# EAGLE design Groovegrid_ctrl (EAGLE 9.6.1)
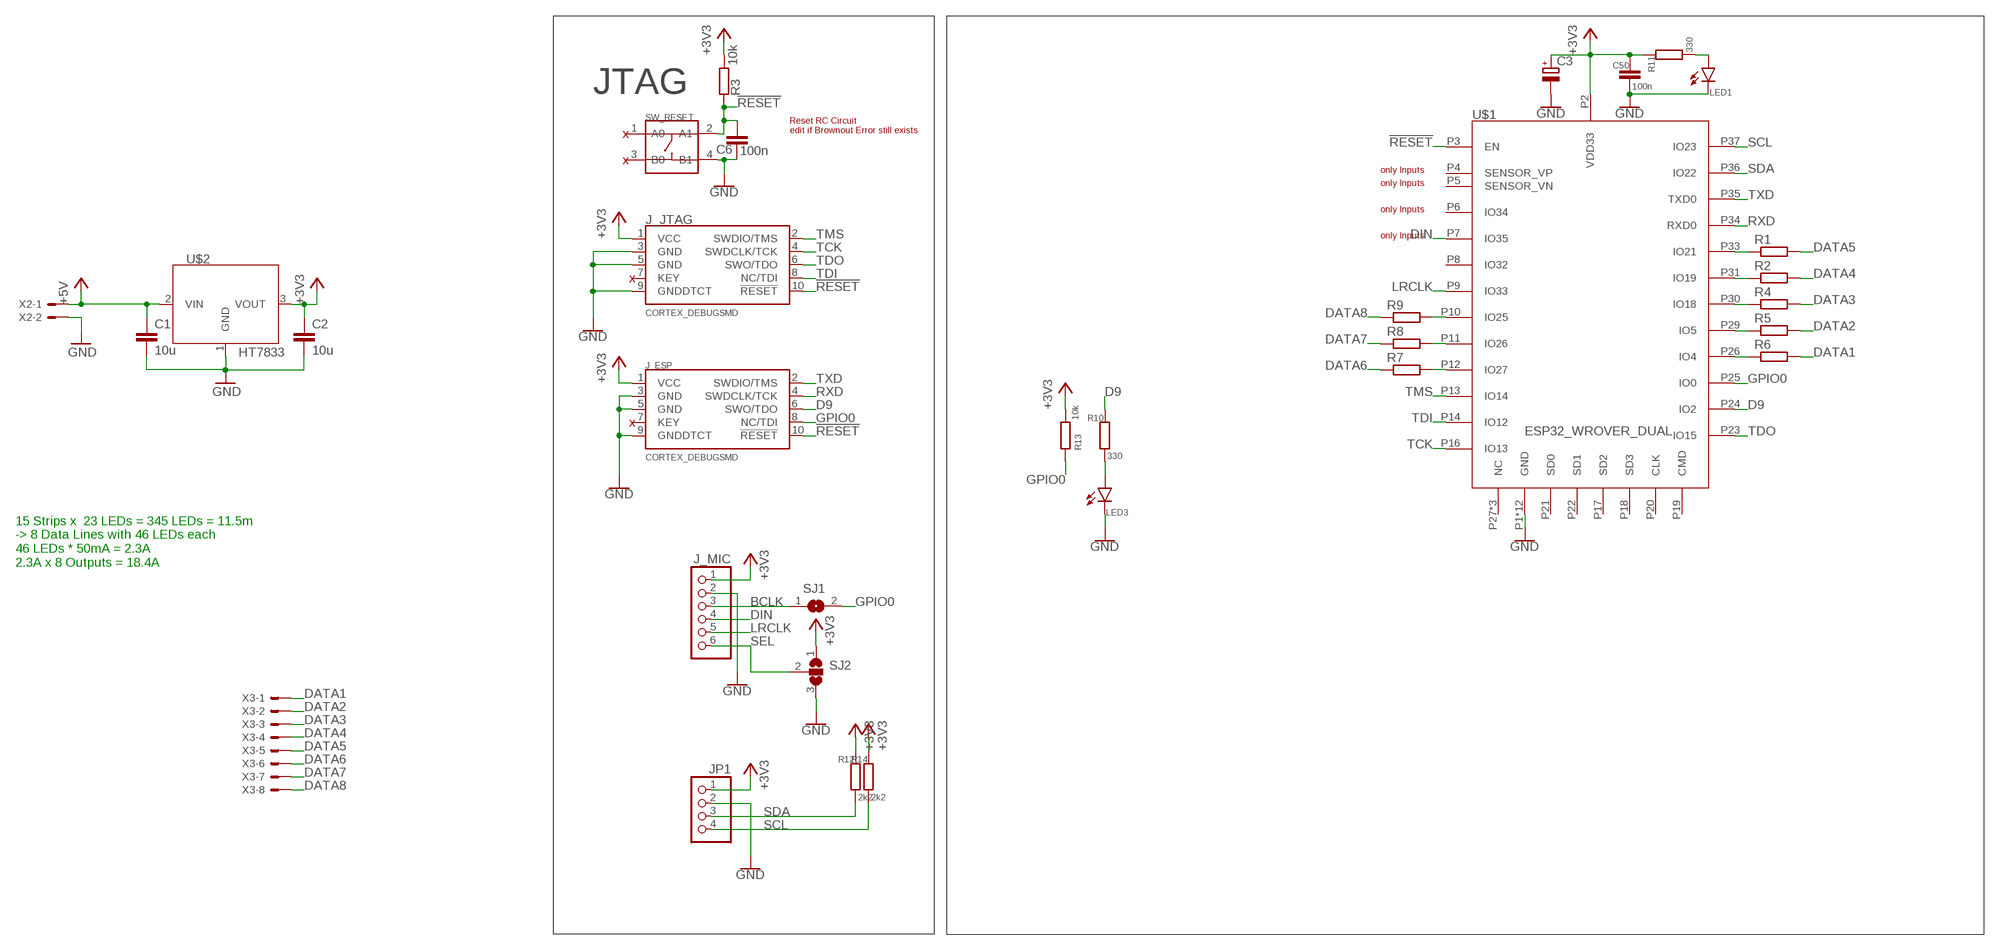
[diagram p0: schematic, sheet 1]

## Parts
C1  10u  C-EUC0805  [C0805]
C2  10u  C-EUC0805  [C0805]
C3  CPOL-EUD  [PANASONIC_D]
C6  100n  C-EUC0805K  [C0805K]
C50  100n  C-EUC0805K  [C0805K]
J_ESP  CORTEX_DEBUGSMD  [2X5_FTSH-105]
J_JTAG  CORTEX_DEBUGSMD  [2X5_FTSH-105]
J_MIC  PINHD-1X6  [1X06]
JP1  PINHD-1X4  [1X04]
LED1  LEDCHIPLED_0805  [CHIPLED_0805]
LED3  LEDCHIPLED_0805  [CHIPLED_0805]
R1  R-EU_R0805  [R0805]
R2  R-EU_R0805  [R0805]
R3  10k  R-EU_R0805  [R0805]
R4  R-EU_R0805  [R0805]
R5  R-EU_R0805  [R0805]
R6  R-EU_R0805  [R0805]
R7  R-EU_R0805  [R0805]
R8  R-EU_R0805  [R0805]
R9  R-EU_R0805  [R0805]
R10  330  R-EU_R0805  [R0805]
R11  330  R-EU_R0805  [R0805]
R12  2k2  R-EU_R0805  [R0805]
R13  10k  R-EU_R0805  [R0805]
R14  2k2  R-EU_R0805  [R0805]
SJ1  SJ  [SJ]
SJ2  SJ2W  [SJ_2]
SW_RESET  SKQGADE010  SMD-BUTTON(4P-5.2X5.2X1.5MM-SKQGADE010)  [SW_4P-5.2X5.2X1.5MM]
U$1  ESP32_WROVER_DUAL  [ESP32_WROVER]
U$2  HT7833  [SOT150P417X160-4N]
X2  JST-XH-02-PIN-ROUND-PAD  [JST-XH-02-PACKAGE-ROUND-PAD]
X3  JST-XH-08-PIN-ROUND-PAD  [JST-XH-08-PACKAGE-ROUND-PAD]

## Nets
!RESET: C6.1 J_ESP.10(!RESET) J_JTAG.10(!RESET) R3.1 SW_RESET.2(A1) U$1.P3(EN)
+3V3: C2.1 C3.+ C50.1 J_ESP.1(VCC) J_JTAG.1(VCC) J_MIC.1 JP1.1 R3.2 R11.1 R12.1 R13.2 R14.1 SJ2.1 U$1.P2(VDD33) U$2.3(VOUT)
+5V: C1.1 U$2.2(VIN) X2.1
BCLK: J_MIC.3 SJ1.1
D9: J_ESP.6(SWO/TDO) R10.1 U$1.P24(IO2)
DATA1: R6.2 X3.1
DATA2: R5.2 X3.2
DATA3: R4.2 X3.3
DATA4: R2.2 X3.4
DATA5: R1.2 X3.5
DATA6: R7.1 X3.6
DATA7: R8.1 X3.7
DATA8: R9.1 X3.8
DIN: J_MIC.4 U$1.P7(IO35)
GND: C1.2 C2.2 C3.- C6.2 C50.2 J_ESP.3(GND) J_ESP.5(GND) J_ESP.9(GNDDTCT) J_JTAG.3(GND) J_JTAG.5(GND) J_JTAG.9(GNDDTCT) J_MIC.2 JP1.2 LED1.C LED3.C SJ2.3 SW_RESET.4(B1) U$1.P1(GND) U$1.P15(GND) U$1.P38(GND) U$1.TH1(GND) U$1.TH2(GND) U$1.TH3(GND) U$1.TH4(GND) U$1.TH5(GND) U$1.TH6(GND) U$1.TH7(GND) U$1.TH8(GND) U$1.TH9(GND) U$2.1(GND) X2.2
GPIO0: J_ESP.8(NC/TDI) R13.1 SJ1.2 U$1.P25(IO0)
LRCLK: J_MIC.5 U$1.P9(IO33)
N$1: R1.1 U$1.P33(IO21)
N$2: R2.1 U$1.P31(IO19)
N$3: R4.1 U$1.P30(IO18)
N$4: R5.1 U$1.P29(IO5)
N$5: LED3.A R10.2
N$6: R6.1 U$1.P26(IO4)
N$7: R7.2 U$1.P12(IO27)
N$8: R8.2 U$1.P11(IO26)
N$9: R9.2 U$1.P10(IO25)
N$10: LED1.A R11.2
RXD: J_ESP.4(SWDCLK/TCK) U$1.P34(RXD0)
SCL: JP1.4 R14.2 U$1.P37(IO23)
SDA: JP1.3 R12.2 U$1.P36(IO22)
SEL: J_MIC.6 SJ2.2
TCK: J_JTAG.4(SWDCLK/TCK) U$1.P16(IO13)
TDI: J_JTAG.8(NC/TDI) U$1.P14(IO12)
TDO: J_JTAG.6(SWO/TDO) U$1.P23(IO15)
TMS: J_JTAG.2(SWDIO/TMS) U$1.P13(IO14)
TXD: J_ESP.2(SWDIO/TMS) U$1.P35(TXD0)
Unconnected: J_ESP.7(KEY) J_JTAG.7(KEY) SW_RESET.1(A0) SW_RESET.3(B0) U$1.P4(SENSOR_VP) U$1.P5(SENSOR_VN) U$1.P6(IO34) U$1.P8(IO32) U$1.P17(SD2) U$1.P18(SD3) U$1.P19(CMD) U$1.P20(CLK) U$1.P21(SD0) U$1.P22(SD1) U$1.P27(NC) U$1.P28(NC) U$1.P32(NC)

## Notes on the sheet
- JTAG
- x
- Reset RC Circuit
  edit if Brownout Error still exists
- x
- only Inputs
- only Inputs
- only Inputs
- only Inputs
- x
- x
- 15 Strips x  23 LEDs = 345 LEDs = 11.5m
  -> 8 Data Lines with 46 LEDs each
  46 LEDs * 50mA = 2.3A
  2.3A x 8 Outputs = 18.4A

## Library data of the parts
C1 C2 C6 C50 = resistor:C-EU: CAPACITOR, European symbol
C3 = resistor:CPOL-EU: POLARIZED CAPACITOR, European symbol
J_ESP J_JTAG = philmalessa:CORTEX_DEBUG: Cortex Debug Connector - 10 pin Supports JTAG debug, Serial Wire debug, and Serial Wire Viewer. PTH and SMD connector options available. General Connector Information <http://infocenter.arm.com/help/topic/com.arm.doc.faqs/attached/13634/cortex_debug_connectors.pdf> Products: PTH Connector <http://www.digikey.com/product-detail/en/cnc-tech/3220-10-0100-00/1175-1627-ND/3883661> -via Digi-Key SparkFun PSoc <https://www.sparkfun.com/products/13229> SparkFun T <https://www.sparkfun.com/products/13810>
J_MIC = pinhead:PINHD-1X6: PIN HEADER
JP1 = pinhead:PINHD-1X4: PIN HEADER
LED1 LED3 = led:LED: LED OSRAM: - CHIPLED LG R971, LG N971, LY N971, LG Q971, LY Q971, LO R971, LY R971 LH N974, LH R974 LS Q976, LO Q976, LY Q976 LO Q996 - Hyper CHIPLED LW Q18S LB Q993, LB Q99A, LB R99A - SideLED LS A670, LO A670, LY A670, LG A670, LP A670 LB A673, LV A673, LT A673, LW A673 LH A674 LY A675 LS A676, LA A676, LO A676, LY A676, LW A676 LS A679, LY A679, LG A679 - Hyper Micro SIDELED® LS Y876, LA Y876, LO Y876, LY Y876 LT Y87S - SmartLED LW L88C, LW L88S LB L89C, LB L89S, LG L890 LS L89K, LO L89K, LY L89K LS L896, LA L896, LO L896, LY L896 - TOPLED LS T670, LO T670, LY T670, LG T670, LP T670 LSG T670, LSP T670, LSY T670, LOP T670, LYG T670 LG T671, LOG T671, LSG T671 LB T673, LV T673, LT T673, LW T673 LH T674 LS T676, LA T676, LO T676, LY T676, LB T676, LH T676, LSB T676, LW T676 LB T67C, LV T67C, LT T67C, LS T67K, LO T67K, LY T67K, LW E67C LS E67B, LA E67B, LO E67B, LY E67B, LB E67C, LV E67C, LT E67C LW T67C LS T679, LY T679, LG T679 LS T770, LO T770, LY T770, LG T770, LP T770 LB T773, LV T773, LT T773, LW T773 LH T774 LS E675, LA E675, LY E675, LS T675 LS T776, LA T776, LO T776, LY T776, LB T776 LHGB T686 LT T68C, LB T68C - Hyper Mini TOPLED® LB M676 - Mini TOPLED Santana® LG M470 LS M47K, LO M47K, LY M47K Source: http://www.osram.convergy.de LUXEON: - LUMILED® LXK2-PW12-R00, LXK2-PW12-S00, LXK2-PW14-U00, LXK2-PW14-V00 LXK2-PM12-R00, LXK2-PM12-S00, LXK2-PM14-U00 LXK2-PE12-Q00, LXK2-PE12-R00, LXK2-PE12-S00, LXK2-PE14-T00, LXK2-PE14-U00 LXK2-PB12-K00, LXK2-PB12-L00, LXK2-PB12-M00, LXK2-PB14-N00, LXK2-PB14-P00, LXK2-PB14-Q00 LXK2-PR12-L00, LXK2-PR12-M00, LXK2-PR14-Q00, LXK2-PR14-R00 LXK2-PD12-Q00, LXK2-PD12-R00, LXK2-PD12-S00 LXK2-PH12-R00, LXK2-PH12-S00 LXK2-PL12-P00, LXK2-PL12-Q00, LXK2-PL12-R00 Source: www.luxeon.com KINGBRIGHT: KA-3528ASYC Source: www.kingbright.com
R1-R14 = resistor:R-EU_: RESISTOR, European symbol
SJ1 = jumper:SJ: SMD solder JUMPER
SJ2 = jumper:SJ2W: SMD solder JUMPER
SW_RESET = philmalessa:SMD-BUTTON(4P-5.2X5.2X1.5MM-SKQGADE010): 311020017
U$1 = philmalessa:ESP32_WROVER_DUAL
U$2 = philmalessa:HT7833
X2 = Panda:JST-XH-02-PIN: JST XH Connector 2 Pin Wire to board connector. Pitch: 2,54 mm, (0.100") Number of pins: 2 Created by Rembrandt Electronics www.rembrandtelectronics.com
X3 = Panda:JST-XH-08-PIN: JST XH Connector 2 Pin Wire to board connector. Pitch: 2,54 mm, (0.100") Number of pins: 8 Created by Rembrandt Electronics www.rembrandtelectronics.com

## Board
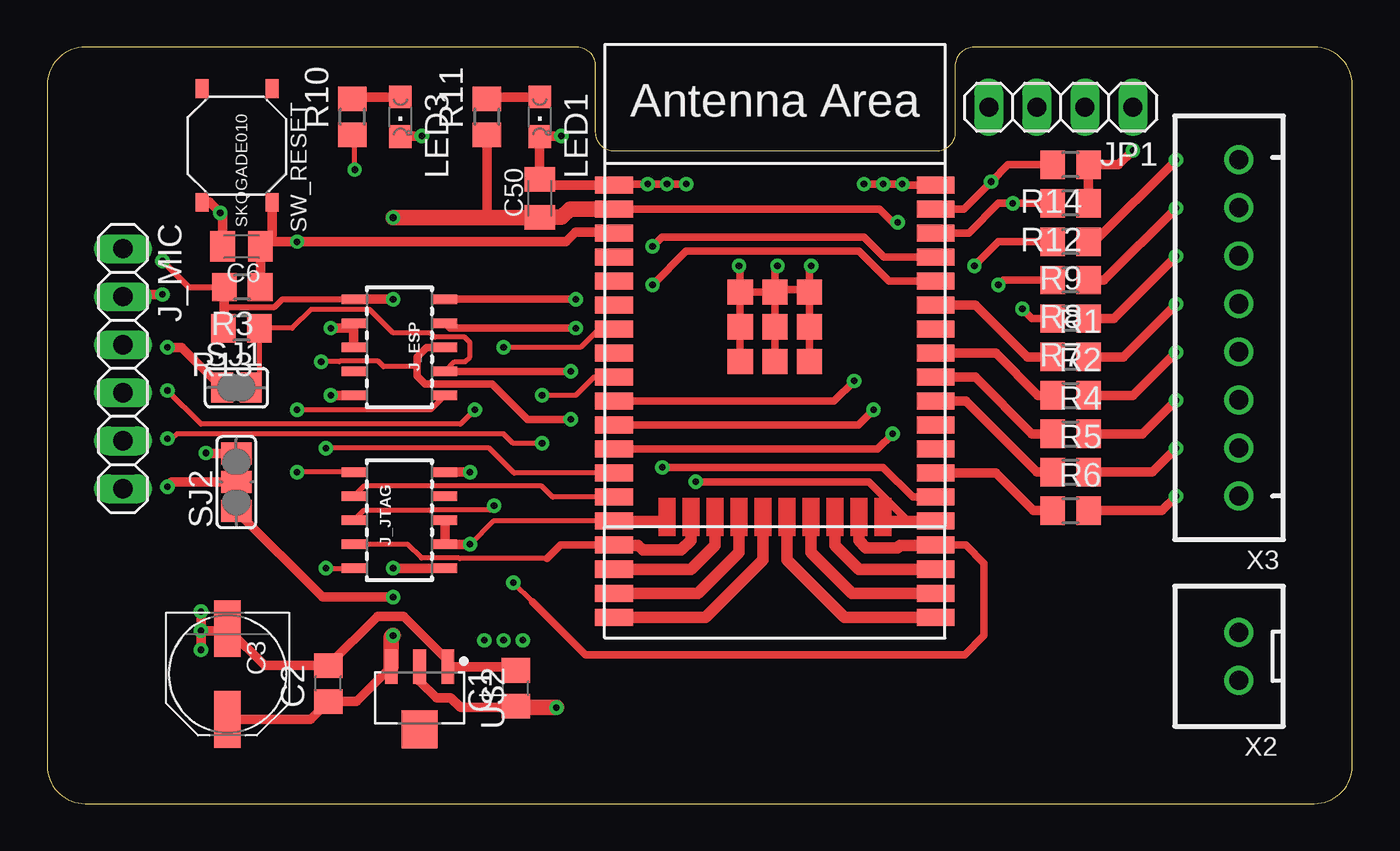
[diagram p1: board, top side]
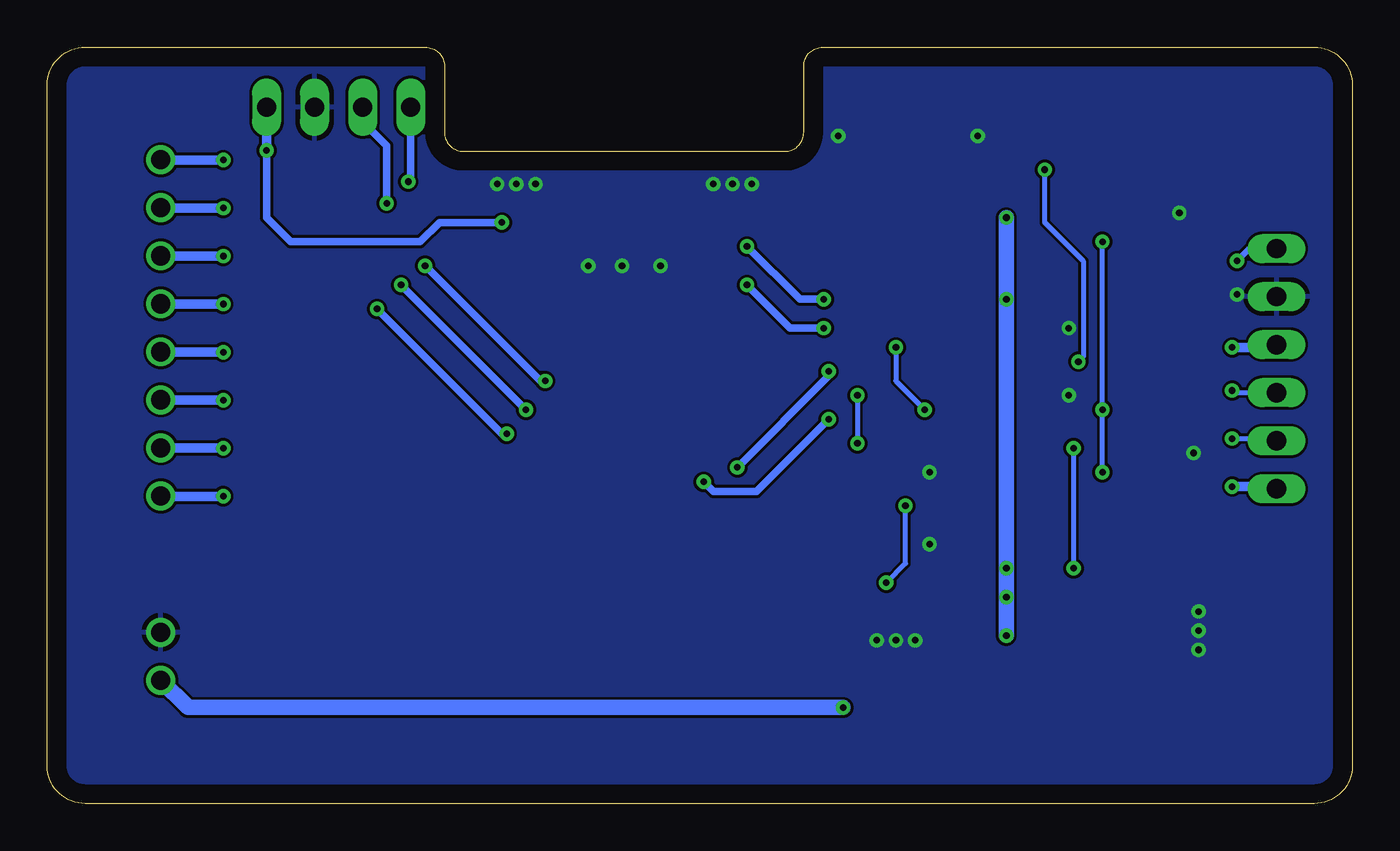
[diagram p2: board, bottom side, seen from below]

Size 69 x 40 mm. Coordinates in mm from the lower left corner, seen from the top.
Outline: 0,38 0,2 arc90 2,0 67,0 arc90 69,2 69,38 arc90 67,40 49,40 arc90 48,39 48,35.5 arc-90 47,34.5 30,34.5 arc-90 29,35.5 29,39 arc90 28,40 2,40 arc90 0,38
Copper layers (1*16): Top 0.035mm / dielectric 1.5mm / Bottom 0.035mm
Design rules "default": minimum track width 6mil, minimum drill 0.35mm, track to track 6mil, track to pad 6mil, pad to pad 6mil, via to via 6mil, smd to smd 6mil, copper to edge 40mil, drill to drill 6mil, minimum pad ring 10mil, minimum via ring 8mil, stop-mask expansion 4mil, vias tented up to drill 0mil, thermal gap 10mil

### Footprints (pad centres in the part's own frame; a part is rotated, then mirrored left to right if it is on the bottom)
C0805 = smd 1.3 x 1.5: 1 -0.95,0; 2 0.95,0
PANASONIC_D = smd 3 x 1.4: + 2.4,0; - -2.4,0
C0805K = smd 1.3 x 1.6: 1 -1,0; 2 1,0
2X5_FTSH-105 = smd 0.508 x 1.27: 1 -2.54,-2.413; 2 -2.54,2.413; 3 -1.27,-2.413; 4 -1.27,2.413; 5 0,-2.413; 6 0,2.413; 7 1.27,-2.413; 8 1.27,2.413; 9 2.54,-2.413; 10 2.54,2.413
1X06 = drill 1.016 long: 1 -6.35,0; 2 -3.81,0; 3 -1.27,0; 4 1.27,0; 5 3.81,0; 6 6.35,0
1X04 = drill 1.016 long: 1 -3.81,0; 2 -1.27,0; 3 1.27,0; 4 3.81,0
CHIPLED_0805 = smd 1.2 x 1.2: A 0,-1.05; C 0,1.05
R0805 = smd 1.3 x 1.5: 1 -0.95,0; 2 0.95,0
SJ = smd 1.168 x 1.6: 1 -0.762,0; 2 0.762,0
SJ_2 = smd 1.168 x 1.6: 1 -1.524,0; 2 0,0; 3 1.524,0
SW_4P-5.2X5.2X1.5MM = smd 1 x 0.7: 1 -3,1.85; 2 3,1.85; 3 -3,-1.85; 4 3,-1.85
ESP32_WROVER = smd 2 x 0.9: P1 -8.5,7.5; P2 -8.5,6.23; P3 -8.5,4.96; P4 -8.5,3.69; P5 -8.5,2.42; P6 -8.5,1.15; P7 -8.5,-0.12; P8 -8.5,-1.39; P9 -8.5,-2.66; P10 -8.5,-3.93; P11 -8.5,-5.2; P12 -8.5,-6.47; P13 -8.5,-7.74; P14 -8.5,-9.01; P15 -8.5,-10.28; P16 -8.5,-11.55; P17 -8.5,-12.82; P18 -8.5,-14.09; P19 -8.5,-15.36; P20 8.5,-15.36; P21 8.5,-14.09; P22 8.5,-12.82; P23 8.5,-11.55; P24 8.5,-10.28; P25 8.5,-9.01; P26 8.5,-7.74; P27 8.5,-6.47; P28 8.5,-5.2; P29 8.5,-3.93; P30 8.5,-2.66; P31 8.5,-1.39; P32 8.5,-0.12; P33 8.5,1.15; P34 8.5,2.42; P35 8.5,3.69; P36 8.5,4.96; P37 8.5,6.23; P38 8.5,7.5 | smd 1.33 x 1.33: TH1 -1.835,1.835; TH2 0,1.835; TH3 1.835,1.835; TH4 -1.835,0; TH5 0,0; TH6 1.835,0; TH7 -1.835,-1.835; TH8 0,-1.835; TH9 1.835,-1.835
SOT150P417X160-4N = smd 1.808 x 0.664: 1 -1.653,1.5; 2 -1.653,0; 3 -1.653,-1.5 | smd 2.008 x 1.903: 4 1.653,0
JST-XH-02-PACKAGE-ROUND-PAD = drill 1.016: 1 -1.27,0; 2 1.27,0
JST-XH-08-PACKAGE-ROUND-PAD = drill 1.016: 1 -8.89,0; 2 -6.35,0; 3 -3.81,0; 4 -1.27,0; 5 1.27,0; 6 3.81,0; 7 6.35,0; 8 8.89,0

### Placement (x,y rotation side)
C1  24.77,6.1 90 top
C2  14.86,6.35 90 top
C3  9.53,6.86 270 top
C6  10.27,29.46 180 top
C50  26.04,32 90 top
J_ESP  18.62,24.13 270 top
J_JTAG  18.62,14.99 90 top
J_MIC  4,23 270 top
JP1  53.59,36.83 180 top
LED1  26.04,36.32 180 top
LED3  18.67,36.32 180 top
R1  54.1,23.62 0 top
R2  54.1,21.59 0 top
R3  10.31,27.32 180 top
R4  54.1,19.56 0 top
R5  54.1,17.53 0 top
R6  54.1,15.49 0 top
R7  54.1,25.65 180 top
R8  54.1,27.69 180 top
R9  54.1,29.72 180 top
R10  16.13,36.32 90 top
R11  23.24,36.32 90 top
R12  54.1,31.75 180 top
R13  10.27,25.15 180 top
R14  54.1,33.78 180 top
SJ1  10,22 0 top
SJ2  10,17 90 top
SW_RESET  10.04,34.8 270 top
U$1  38.47,25.22 0 top
U$2  19.69,5.59 270 top
X2  63,7.79 90 top
X3  63,25.16 90 top

### Tracks (layer width: path | path; a pad name or v marks a point on that pad's centre or on a via)
!RESET  (via drill 0.35)
  Top 0.254: J_JTAG.10 v13.21,17.53 | J_ESP.10 20.27,20.83 v13.21,20.83
  Top 0.508: SW_RESET.2 11.89,30.08 C6.1 | C6.1 11.27,27.33 R3.1 | C6.1 11.53,29.72 v13.21,29.72 27.43,29.72 27.94,30.23 29.93,30.23 U$1.P3
  Bottom 0.254: v13.21,17.53 v13.21,20.83 v13.21,29.72
+3V3  (via drill 0.35)
  Top 0.305: J_ESP.1 12.44,26.67 12.03,26.26 9.46,26.26 9.36,26.16 | R3.2 7.48,27.32 v6.1,28.7
  Top 0.406: v44.96,30.73 44.7,30.73 43.99,31.45 U$1.P2
  Top 0.508: U$2.3 16.35,5.4 C2.1 13.92,4.46 C3.+ | R11.1 23.24,31.11 23.37,30.99 | J_JTAG.1 v18.29,12.45 | SJ2.1 14.55,10.92 v18.29,10.92 | J_ESP.1 v18.29,26.67 | R3.2 9.36,26.16 9.36,25.18 R13.2 | R12.1 R14.1 56.64,33.78 v57.4,34.54
  Top 0.813: U$2.3 18.19,8.79 v18.29,8.89 | v18.29,30.99 23.37,30.99 26.02,30.99 C50.1 27.19,31 27.64,31.45 U$1.P2
  Bottom 0.305: J_MIC.1 5.45,29.35 v6.1,28.7
  Bottom 0.406: v44.96,30.73 48.26,30.73 49.28,29.72 56.13,29.72 57.4,30.99 v57.4,34.54
  Bottom 0.508: v57.4,34.54 JP1.1
  Bottom 0.813: v18.29,8.89 v18.29,10.92 v18.29,12.45 v18.29,26.67 v18.29,30.99
+5V  (via drill 0.35)
  Top 0.508: U$2.2 19.69,6.47 20.57,5.59 21.34,5.59 21.84,5.08 24.83,5.08
  Top 0.813: v26.92,5.08 24.83,5.08 C1.1
  Bottom 0.813: X2.1 61.56,5.08 v26.92,5.08
BCLK  (via drill 0.35)
  Top 0.508: SJ1.1 7.11,24.13 v6.35,24.13
  Bottom 0.508: v6.35,24.13 4.14,24.13 J_MIC.3
D9  (via drill 0.35)
  Top 0.254: 19.56,23.11 17.78,23.11 17.5,23.39 15.46,23.39 15.44,23.37 v14.48,23.37 | v16.26,33.53 16.26,35.25 R10.1
  Top 0.406: U$1.P24 45.51,14.94 43.43,17.02 v34.29,17.02 | v27.69,20.32 25.4,20.32 23.52,22.2 19.96,22.2 19.56,22.61 19.56,23.11 19.56,23.62 20.07,24.13 J_ESP.6
  Bottom 0.254: v14.48,23.37 14.22,23.62 14.22,28.7 16.26,30.73 v16.26,33.53
  Bottom 0.406: v34.29,17.02 33.78,16.51 31.5,16.51 v27.69,20.32
DATA1  (via drill 0.35)
  Top 0.508: v59.69,16.26 58.93,15.49 R6.2
  Bottom 0.508: v59.69,16.26 62.98,16.26 X3.1
DATA2  (via drill 0.35)
  Top 0.508: v59.69,18.8 58.42,17.53 R5.2
  Bottom 0.508: v59.69,18.8 62.98,18.8 X3.2
DATA3  (via drill 0.35)
  Top 0.508: v59.69,21.34 57.91,19.56 R4.2
  Bottom 0.508: v59.69,21.34 62.98,21.34 X3.3
DATA4  (via drill 0.35)
  Top 0.508: R2.2 57.4,21.59 v59.69,23.88
  Bottom 0.508: v59.69,23.88 59.71,23.89 X3.4
DATA5  (via drill 0.35)
  Top 0.508: R1.2 56.9,23.62 v59.69,26.42
  Bottom 0.508: v59.69,26.42 62.98,26.42 X3.5
DATA6  (via drill 0.35)
  Top 0.508: R7.1 56.39,25.65 v59.69,28.96
  Bottom 0.508: v59.69,28.96 62.98,28.96 X3.6
DATA7  (via drill 0.35)
  Top 0.508: R8.1 55.88,27.69 v59.69,31.5
  Bottom 0.508: v59.69,31.5 62.98,31.5 X3.7
DATA8  (via drill 0.35)
  Top 0.508: R9.1 55.37,29.72 v59.69,34.04
  Bottom 0.508: v59.69,34.04 62.98,34.04 X3.8
DIN  (via drill 0.35)
  Top 0.254: U$1.P7 29.16,25.1 28.19,24.13 v24.13,24.13 | v22.61,20.83 21.84,20.07 8.13,20.07 v6.35,21.84
  Bottom 0.254: v24.13,24.13 24.13,22.35 v22.61,20.83 | v6.35,21.84 6.24,21.73 J_MIC.4
GND  (via drill 0.35)
  Top 0.254: U$1.P15 23.57,14.94 v22.35,13.72
  Top 0.406: U$1.P1 30.02,32.77 v31.75,32.77 v32.77,32.77 v33.78,32.77 | U$1.P38 45.26,32.72 v45.21,32.77 v44.2,32.77 v43.18,32.77 | U$1.TH7 U$1.TH4 U$1.TH1 | U$1.TH1 36.64,28.39 v36.58,28.45 | U$1.TH8 U$1.TH5 U$1.TH2 | U$1.TH2 38.47,27.18 | 38.47,27.18 38.47,28.31 v38.61,28.45 | U$1.TH9 U$1.TH6 U$1.TH3 | U$1.TH3 40.31,28.37 v40.39,28.45 | U$1.TH3 40.18,27.18 38.47,27.18 | U$1.TH1 U$1.TH2
  Top 0.508: U$1.P1 26.32,32.72 C50.2 LED1.C 26.07,35.31 v27.18,35.31 | 9.64,9.14 11.49,7.3 C2.2 17.47,9.91 18.83,9.91 21.19,7.55 U$2.1 24.57,7.24 C1.2 | 9.64,9.14 C3.- | v8.13,10.16 v8.13,9.14 | v8.13,9.14 v8.13,8.13 | v8.13,9.14 9.64,9.14 | SJ2.3 8.4,18.52 v8.38,18.54 | J_ESP.9 v14.99,21.59 | J_JTAG.9 v22.35,17.53 | v22.35,13.72 J_JTAG.3 J_JTAG.5 | v14.99,25.15 15.96,25.15 J_ESP.3 J_ESP.5 | LED3.C 18.71,35.31 v19.81,35.31 | SW_RESET.4 8.59,31.8 v9.14,31.24 9.27,31.11 C6.2 | J_MIC.2 4.11,26.92 v6.1,26.92
  other vias: 23.11,8.64 24.13,8.64 25.15,8.64
  pour Bottom: 0,40 69,40 69,0 0,0
GPIO0  (via drill 0.35)
  Top 0.254: J_ESP.8 21.55,23.37 22.1,23.37 22.35,23.62 22.35,24.38 22.07,24.66 20.49,24.66 20.26,24.89 18.29,24.89 17.04,26.14 13.95,26.14 12.95,25.15 R13.1 11.22,22.46 SJ1.2
  Top 0.406: U$1.P25 45.77,16.21 44.2,17.78 v32.51,17.78 | v27.69,22.86 J_ESP.8
  Bottom 0.406: v32.51,17.78 27.69,22.61 v27.69,22.86
LRCLK  (via drill 0.35)
  Top 0.254: U$1.P9 28.91,22.56 27.94,21.59 v26.16,21.59 | v26.16,19.05 24.64,19.05 24.13,19.56 6.86,19.56 6.6,19.3 v6.35,19.3
  Bottom 0.254: v26.16,21.59 v26.16,19.05 | v6.35,19.3 4.11,19.3 J_MIC.5
N$1
  Top 0.508: R1.1 51.82,23.62 49.07,26.37 U$1.P33
N$2
  Top 0.508: U$1.P31 50.15,23.83 52.39,21.59 R2.1
N$3
  Top 0.508: R4.1 52.07,19.56 49.07,22.56 U$1.P30
N$4
  Top 0.508: R5.1 52.32,17.53 48.56,21.29 U$1.P29
N$5
  Top 0.508: R10.2 16.23,37.37 LED3.A
N$6
  Top 0.508: R6.1 52.14,15.49 50.15,17.48 U$1.P26
N$7  (via drill 0.35)
  Top 0.406: R7.2 52.07,25.65 v51.56,26.16 | v44.7,19.56 43.89,18.75 U$1.P12
  Bottom 0.406: v51.56,26.16 44.96,19.56 v44.7,19.56
N$8  (via drill 0.35)
  Top 0.406: R8.2 50.55,27.69 v50.29,27.43 | v43.69,20.83 42.88,20.02 U$1.P11
  Bottom 0.406: v50.29,27.43 v43.69,20.83
N$9  (via drill 0.35)
  Top 0.406: R9.2 50.29,29.72 v49.02,28.45 | v42.67,22.35 41.61,21.29 U$1.P10
  Bottom 0.406: v49.02,28.45 42.93,22.35 v42.67,22.35
N$10
  Top 0.508: R11.2 23.34,37.37 LED1.A
RXD  (via drill 0.35)
  Top 0.406: U$1.P34 44.5,27.64 42.93,29.21 33.78,29.21 v32,27.43 | v27.94,25.15 21.29,25.15 J_ESP.4
  Bottom 0.406: v32,27.43 29.72,25.15 v27.94,25.15
SCL  (via drill 0.35)
  Top 0.406: U$1.P37 48.47,31.45 v49.91,32.89 50.8,33.78 R14.2
  Bottom 0.406: JP1.4 49.78,33.02 v49.91,32.89
SDA  (via drill 0.35)
  Top 0.406: U$1.P36 48.72,30.18 50.29,31.75 v51.05,31.75 R12.2
  Bottom 0.406: JP1.3 52.32,36.07 51.05,34.8 v51.05,31.75
SEL  (via drill 0.35)
  Top 0.508: SJ2.2 6.59,17 v6.35,16.76
  Bottom 0.508: v6.35,16.76 4.11,16.76 J_MIC.6
TCK
  Top 0.254: 26.42,12.95 21.81,12.95 21.79,12.98 19.79,12.98 19.05,13.72 J_JTAG.4
  Top 0.406: U$1.P16 27.13,13.67 26.42,12.95
TDI
  Top 0.254: U$1.P14 26.72,16.21 26.14,16.79 16.74,16.79 J_JTAG.8
TDO  (via drill 0.35)
  Top 0.254: 25.65,10.67 v24.64,11.68 | v23.62,15.75 23.39,15.52 20.29,15.52 20.26,15.49 16.72,15.49 J_JTAG.6
  Top 0.406: U$1.P23 48.56,13.67 49.53,12.7 49.53,8.89 48.51,7.87 28.45,7.87 25.65,10.67
  Bottom 0.254: v24.64,11.68 23.62,12.7 v23.62,15.75
TMS  (via drill 0.35)
  Top 0.254: U$1.P13 24.69,17.48 23.37,18.8 v14.73,18.8 | v14.73,12.45 J_JTAG.2
  Bottom 0.254: v14.73,18.8 v14.73,12.45
TXD  (via drill 0.35)
  Top 0.406: U$1.P35 44.24,28.91 43.18,29.97 32.51,29.97 v32,29.46 | v27.94,26.67 J_ESP.2
  Bottom 0.406: v32,29.46 29.21,26.67 v27.94,26.67

### Text on the board
tPrint: I2C | 1 | 1 | 1 | ESP Prog | Mic | 1 | JTAG | GrooveGrid Controller | Version 1.0 - 08/2020 | made by Phil Malessa